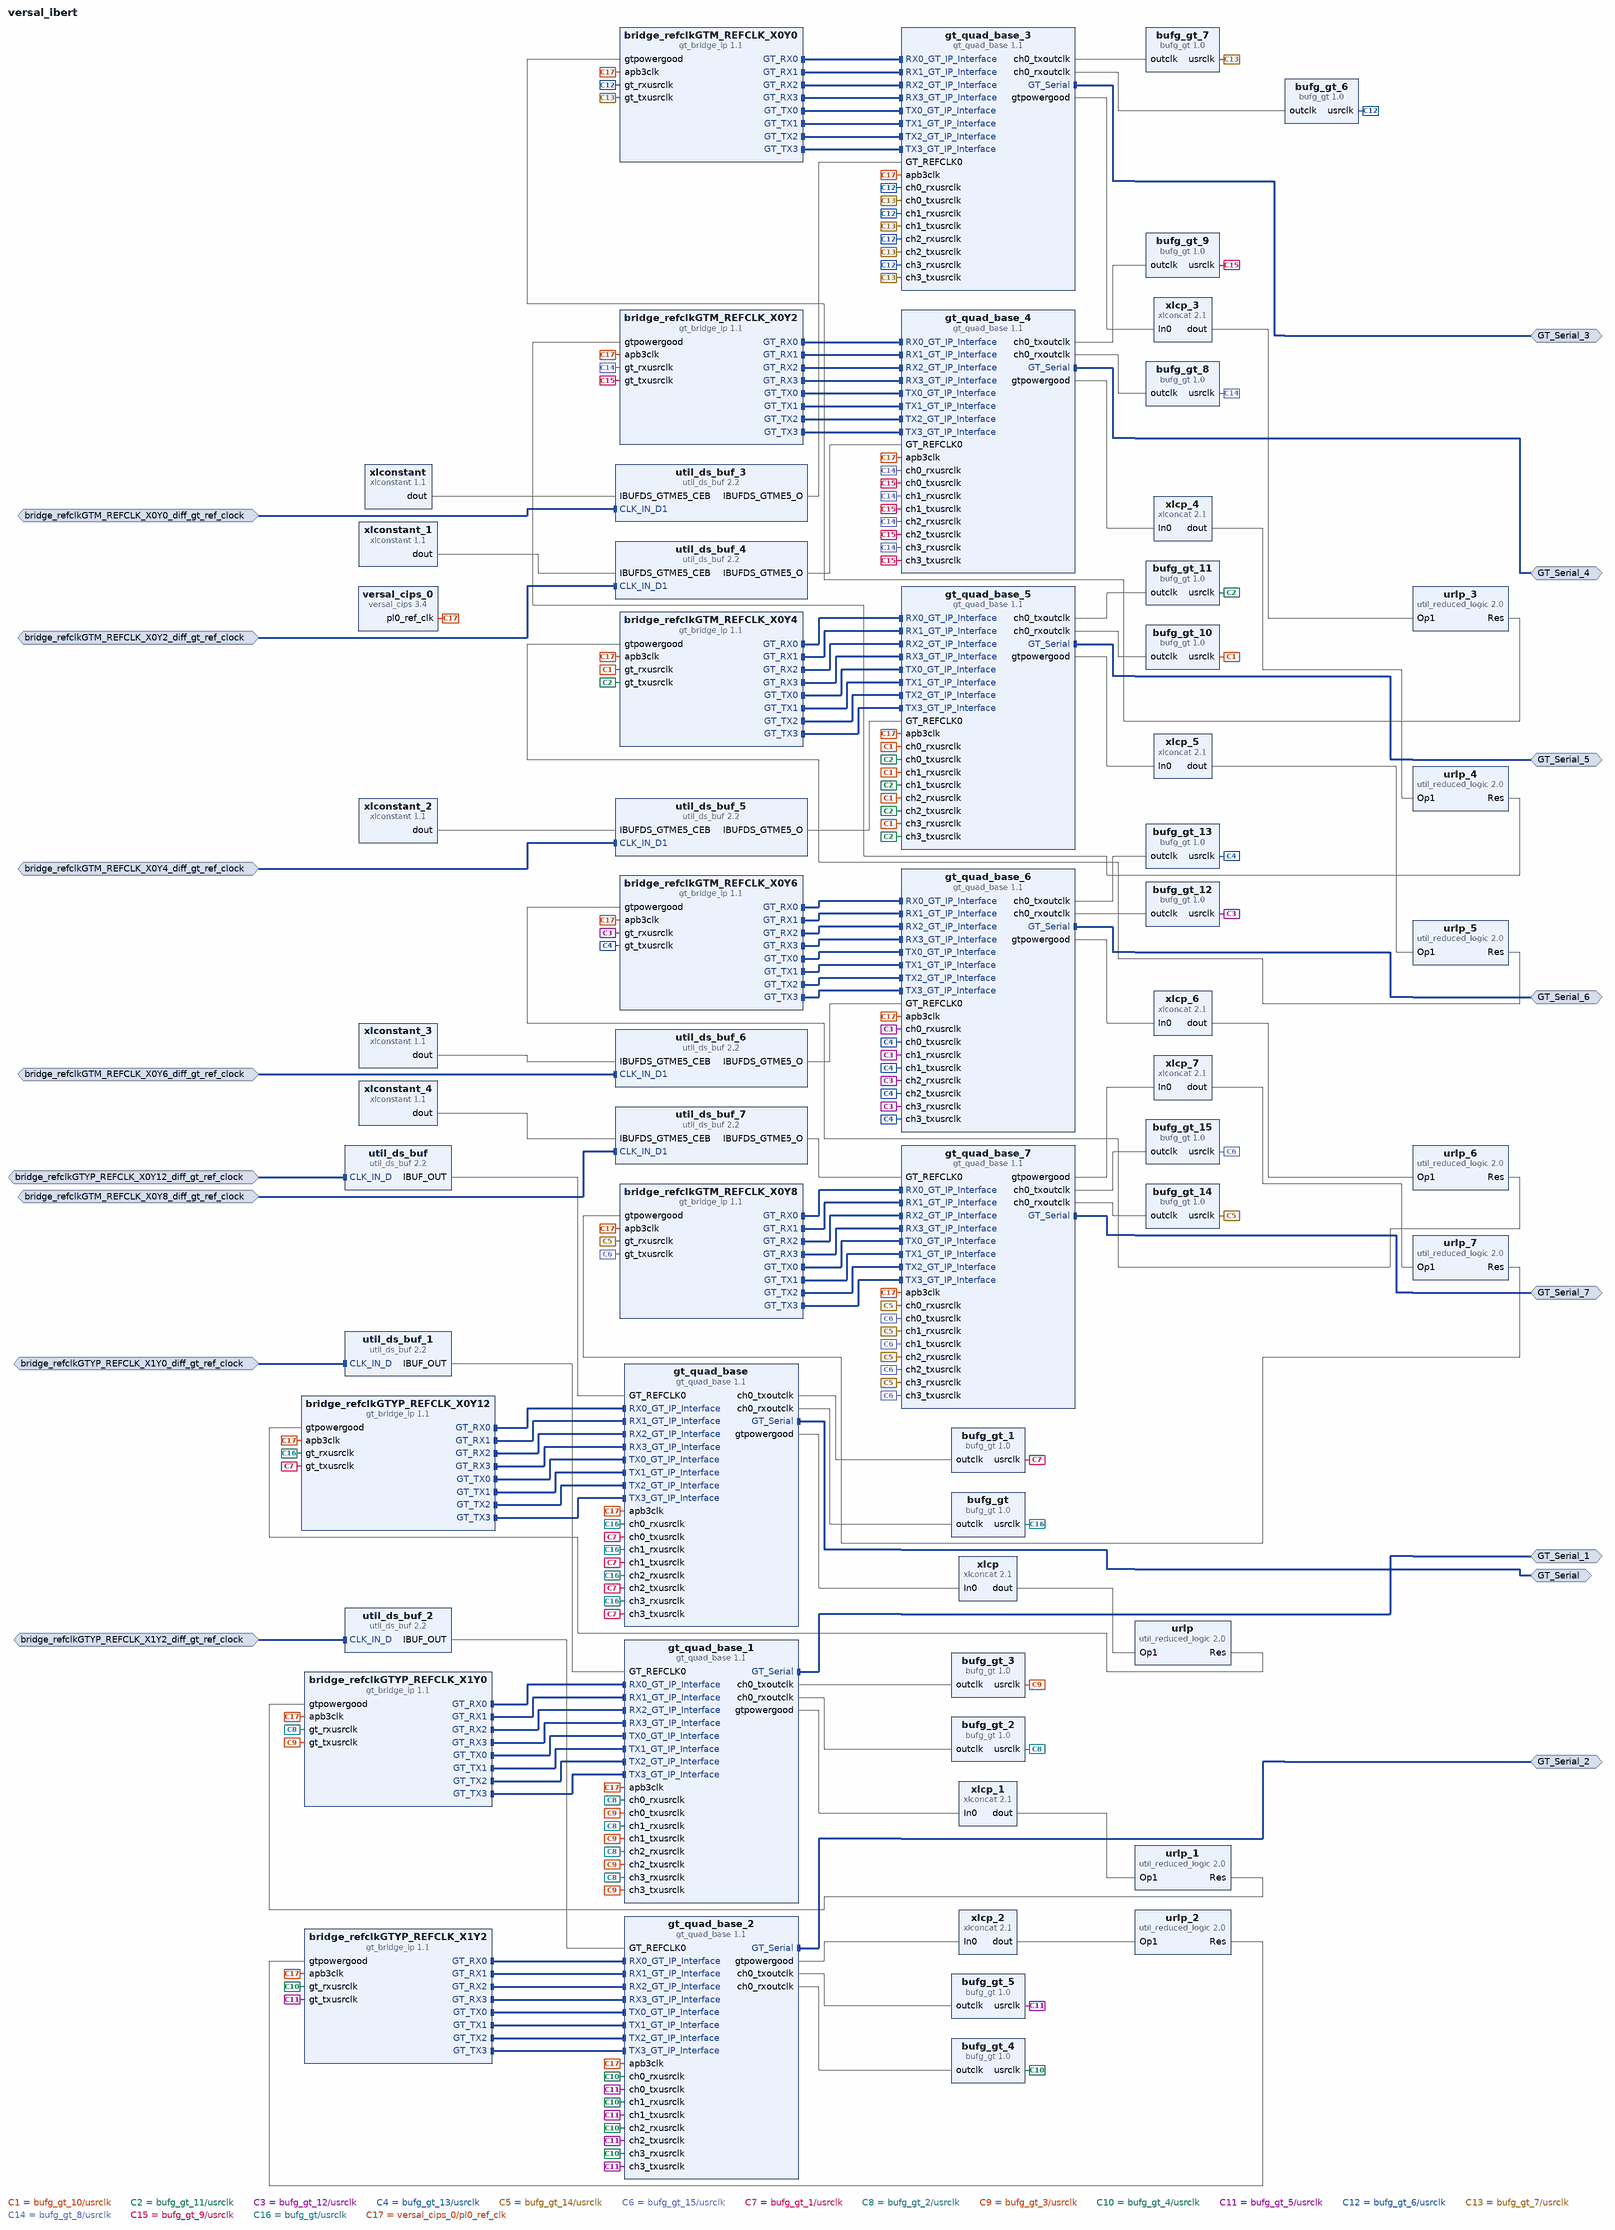
[diagram p0: block diagram of the top level]
# Vivado block design versal_ibert, xcvp1202-vsva2785-2MHP-e-S, Vivado 2023.2
create_bd_design versal_ibert

create_bd_intf_port -mode Slave -vlnv xilinx.com:interface:diff_clock_rtl:1.0 bridge_refclkGTYP_REFCLK_X0Y12_diff_gt_ref_clock
set_property -dict {CONFIG.FREQ_HZ 156250000} [get_bd_intf_ports bridge_refclkGTYP_REFCLK_X0Y12_diff_gt_ref_clock]
create_bd_intf_port -mode Master -vlnv xilinx.com:interface:gt_rtl:1.0 GT_Serial
create_bd_intf_port -mode Slave -vlnv xilinx.com:interface:diff_clock_rtl:1.0 bridge_refclkGTYP_REFCLK_X1Y0_diff_gt_ref_clock
set_property -dict {CONFIG.FREQ_HZ 156250000} [get_bd_intf_ports bridge_refclkGTYP_REFCLK_X1Y0_diff_gt_ref_clock]
create_bd_intf_port -mode Master -vlnv xilinx.com:interface:gt_rtl:1.0 GT_Serial_1
create_bd_intf_port -mode Slave -vlnv xilinx.com:interface:diff_clock_rtl:1.0 bridge_refclkGTYP_REFCLK_X1Y2_diff_gt_ref_clock
set_property -dict {CONFIG.FREQ_HZ 156250000} [get_bd_intf_ports bridge_refclkGTYP_REFCLK_X1Y2_diff_gt_ref_clock]
create_bd_intf_port -mode Master -vlnv xilinx.com:interface:gt_rtl:1.0 GT_Serial_2
create_bd_intf_port -mode Slave -vlnv xilinx.com:interface:diff_clock_rtl:1.0 bridge_refclkGTM_REFCLK_X0Y0_diff_gt_ref_clock
set_property -dict {CONFIG.FREQ_HZ 156250000} [get_bd_intf_ports bridge_refclkGTM_REFCLK_X0Y0_diff_gt_ref_clock]
create_bd_intf_port -mode Master -vlnv xilinx.com:interface:gt_rtl:1.0 GT_Serial_3
create_bd_intf_port -mode Slave -vlnv xilinx.com:interface:diff_clock_rtl:1.0 bridge_refclkGTM_REFCLK_X0Y2_diff_gt_ref_clock
set_property -dict {CONFIG.FREQ_HZ 156250000} [get_bd_intf_ports bridge_refclkGTM_REFCLK_X0Y2_diff_gt_ref_clock]
create_bd_intf_port -mode Master -vlnv xilinx.com:interface:gt_rtl:1.0 GT_Serial_4
create_bd_intf_port -mode Slave -vlnv xilinx.com:interface:diff_clock_rtl:1.0 bridge_refclkGTM_REFCLK_X0Y4_diff_gt_ref_clock
set_property -dict {CONFIG.FREQ_HZ 156250000} [get_bd_intf_ports bridge_refclkGTM_REFCLK_X0Y4_diff_gt_ref_clock]
create_bd_intf_port -mode Master -vlnv xilinx.com:interface:gt_rtl:1.0 GT_Serial_5
create_bd_intf_port -mode Slave -vlnv xilinx.com:interface:diff_clock_rtl:1.0 bridge_refclkGTM_REFCLK_X0Y6_diff_gt_ref_clock
set_property -dict {CONFIG.FREQ_HZ 156250000} [get_bd_intf_ports bridge_refclkGTM_REFCLK_X0Y6_diff_gt_ref_clock]
create_bd_intf_port -mode Master -vlnv xilinx.com:interface:gt_rtl:1.0 GT_Serial_6
create_bd_intf_port -mode Slave -vlnv xilinx.com:interface:diff_clock_rtl:1.0 bridge_refclkGTM_REFCLK_X0Y8_diff_gt_ref_clock
set_property -dict {CONFIG.FREQ_HZ 156250000} [get_bd_intf_ports bridge_refclkGTM_REFCLK_X0Y8_diff_gt_ref_clock]
create_bd_intf_port -mode Master -vlnv xilinx.com:interface:gt_rtl:1.0 GT_Serial_7

create_bd_cell -type ip -vlnv xilinx.com:ip:versal_cips:3.4 versal_cips_0
set_property -dict [list \
  CONFIG.BOOT_MODE Custom \
  CONFIG.CLOCK_MODE Custom \
  CONFIG.DDR_MEMORY_MODE Custom \
  CONFIG.DESIGN_MODE 0 \
  CONFIG.PS_PMC_CONFIG {['CLOCK_MODE Custom DESIGN_MODE 0 PMC_CRP_PL0_REF_CTRL_FREQMHZ 125 PS_BOARD_INTERFACE Custom PS_NUM_FABRIC_RESETS 0 PS_USE_PMCPL_CLK0 1 SMON_ALARMS Set_Alarms_On SMON_ENABLE_TEMP_AVERAGING 0', 'SMON_TEMP_AVERAGING_SAMPLES 0']} \
] [get_bd_cells versal_cips_0]
create_bd_cell -type ip -vlnv xilinx.com:ip:gt_bridge_ip:1.1 bridge_refclkGTYP_REFCLK_X0Y12
set_property -dict [list \
  CONFIG.GT_TYPE GTYP \
  CONFIG.IP_LR0_SETTINGS {['PRESET None RX_PAM_SEL NRZ TX_PAM_SEL NRZ TX_HD_EN 0 RX_HD_EN 0 RX_GRAY_BYP true TX_GRAY_BYP true RX_GRAY_LITTLEENDIAN true TX_GRAY_LITTLEENDIAN true RX_PRECODE_BYP true TX_PRECODE_BYP true', 'RX_PRECODE_LITTLEENDIAN false TX_PRECODE_LITTLEENDIAN false INTERNAL_PRESET None GT_TYPE GTYP GT_DIRECTION DUPLEX TX_LINE_RATE 10.3125 TX_PLL_TYPE LCPLL TX_REFCLK_FREQUENCY 156.25', 'TX_ACTUAL_REFCLK_FREQUENCY 156.250000000000 TX_FRACN_ENABLED false TX_FRACN_OVRD false TX_FRACN_NUMERATOR 0 TX_REFCLK_SOURCE R0 TX_DATA_ENCODING RAW TX_USER_DATA_WIDTH 32 TX_INT_DATA_WIDTH 32', 'TX_BUFFER_MODE 1 TX_BUFFER_BYPASS_MODE Fast_Sync TX_PIPM_ENABLE false TX_OUTCLK_SOURCE TXOUTCLKPMA TXPROGDIV_FREQ_ENABLE false TXPROGDIV_FREQ_SOURCE LCPLL TXPROGDIV_FREQ_VAL 322.265625', 'TX_DIFF_SWING_EMPH_MODE CUSTOM TX_64B66B_SCRAMBLER false TX_64B66B_ENCODER false TX_64B66B_CRC false TX_RATE_GROUP A RX_LINE_RATE 10.3125 RX_PLL_TYPE LCPLL RX_REFCLK_FREQUENCY 156.25', 'RX_ACTUAL_REFCLK_FREQUENCY 156.250000000000 RX_FRACN_ENABLED false RX_FRACN_OVRD false RX_FRACN_NUMERATOR 0 RX_REFCLK_SOURCE R0 RX_DATA_DECODING RAW RX_USER_DATA_WIDTH 32 RX_INT_DATA_WIDTH 32', 'RX_BUFFER_MODE 1 RX_OUTCLK_SOURCE RXOUTCLKPMA RXPROGDIV_FREQ_ENABLE false RXPROGDIV_FREQ_SOURCE LCPLL RXPROGDIV_FREQ_VAL 322.265625 RXRECCLK_FREQ_ENABLE false RXRECCLK_FREQ_VAL 0 INS_LOSS_NYQ 20', 'RX_EQ_MODE AUTO RX_COUPLING AC RX_TERMINATION PROGRAMMABLE RX_RATE_GROUP A RX_TERMINATION_PROG_VALUE 800 RX_PPM_OFFSET 0 RX_64B66B_DESCRAMBLER false RX_64B66B_DECODER false RX_64B66B_CRC false', 'OOB_ENABLE false RX_COMMA_ALIGN_WORD 1 RX_COMMA_SHOW_REALIGN_ENABLE true PCIE_ENABLE false TX_LANE_DESKEW_HDMI_ENABLE false RX_COMMA_P_ENABLE false RX_COMMA_M_ENABLE false RX_COMMA_DOUBLE_ENABLE false', 'RX_COMMA_P_VAL 0101111100 RX_COMMA_M_VAL 1010000011 RX_COMMA_MASK 0000000000 RX_SLIDE_MODE OFF RX_SSC_PPM 0 RX_CB_NUM_SEQ 0 RX_CB_LEN_SEQ 1 RX_CB_MAX_SKEW 1 RX_CB_MAX_LEVEL 1 RX_CB_MASK 00000000', 'RX_CB_VAL 00000000000000000000000000000000000000000000000000000000000000000000000000000000 RX_CB_K 00000000 RX_CB_DISP 00000000 RX_CB_MASK_0_0 false RX_CB_VAL_0_0 00000000 RX_CB_K_0_0 false', 'RX_CB_DISP_0_0 false RX_CB_MASK_0_1 false RX_CB_VAL_0_1 00000000 RX_CB_K_0_1 false RX_CB_DISP_0_1 false RX_CB_MASK_0_2 false RX_CB_VAL_0_2 00000000 RX_CB_K_0_2 false RX_CB_DISP_0_2 false', 'RX_CB_MASK_0_3 false RX_CB_VAL_0_3 00000000 RX_CB_K_0_3 false RX_CB_DISP_0_3 false RX_CB_MASK_1_0 false RX_CB_VAL_1_0 00000000 RX_CB_K_1_0 false RX_CB_DISP_1_0 false RX_CB_MASK_1_1 false RX_CB_VAL_1_1', '00000000 RX_CB_K_1_1 false RX_CB_DISP_1_1 false RX_CB_MASK_1_2 false RX_CB_VAL_1_2 00000000 RX_CB_K_1_2 false RX_CB_DISP_1_2 false RX_CB_MASK_1_3 false RX_CB_VAL_1_3 00000000 RX_CB_K_1_3 false', 'RX_CB_DISP_1_3 false RX_CC_NUM_SEQ 0 RX_CC_LEN_SEQ 1 RX_CC_PERIODICITY 5000 RX_CC_KEEP_IDLE DISABLE RX_CC_PRECEDENCE ENABLE RX_CC_REPEAT_WAIT 0 RX_CC_MASK 00000000 RX_CC_VAL', '00000000000000000000000000000000000000000000000000000000000000000000000000000000 RX_CC_K 00000000 RX_CC_DISP 00000000 RX_CC_MASK_0_0 false RX_CC_VAL_0_0 00000000 RX_CC_K_0_0 false RX_CC_DISP_0_0 false', 'RX_CC_MASK_0_1 false RX_CC_VAL_0_1 00000000 RX_CC_K_0_1 false RX_CC_DISP_0_1 false RX_CC_MASK_0_2 false RX_CC_VAL_0_2 00000000 RX_CC_K_0_2 false RX_CC_DISP_0_2 false RX_CC_MASK_0_3 false RX_CC_VAL_0_3', '00000000 RX_CC_K_0_3 false RX_CC_DISP_0_3 false RX_CC_MASK_1_0 false RX_CC_VAL_1_0 00000000 RX_CC_K_1_0 false RX_CC_DISP_1_0 false RX_CC_MASK_1_1 false RX_CC_VAL_1_1 00000000 RX_CC_K_1_1 false', 'RX_CC_DISP_1_1 false RX_CC_MASK_1_2 false RX_CC_VAL_1_2 00000000 RX_CC_K_1_2 false RX_CC_DISP_1_2 false RX_CC_MASK_1_3 false RX_CC_VAL_1_3 00000000 RX_CC_K_1_3 false RX_CC_DISP_1_3 false', 'PCIE_USERCLK2_FREQ 250 PCIE_USERCLK_FREQ 250 RX_JTOL_FC 6.1862627 RX_JTOL_LF_SLOPE -20 RX_BUFFER_BYPASS_MODE Fast_Sync RX_BUFFER_BYPASS_MODE_LANE MULTI RX_BUFFER_RESET_ON_CB_CHANGE ENABLE', 'RX_BUFFER_RESET_ON_COMMAALIGN DISABLE RX_BUFFER_RESET_ON_RATE_CHANGE ENABLE TX_BUFFER_RESET_ON_RATE_CHANGE ENABLE RESET_SEQUENCE_INTERVAL 0 RX_COMMA_PRESET NONE RX_COMMA_VALID_ONLY 0']} \
  CONFIG.IP_NO_OF_LANES 4 \
] [get_bd_cells bridge_refclkGTYP_REFCLK_X0Y12]
create_bd_cell -type ip -vlnv xilinx.com:ip:gt_quad_base:1.1 gt_quad_base
set_property -dict [list \
  CONFIG.APB3_CLK_FREQUENCY 124.998749 \
  CONFIG.BYPASS_DRC_58G false \
  CONFIG.CHANNEL_ORDERING {['/gt_quad_base/TX0_GT_IP_Interface versal_ibert_bridge_refclkGTYP_REFCLK_X0Y12_0./bridge_refclkGTYP_REFCLK_X0Y12/GT_TX0.0 /gt_quad_base/TX1_GT_IP_Interface', 'versal_ibert_bridge_refclkGTYP_REFCLK_X0Y12_0./bridge_refclkGTYP_REFCLK_X0Y12/GT_TX1.1 /gt_quad_base/TX2_GT_IP_Interface', 'versal_ibert_bridge_refclkGTYP_REFCLK_X0Y12_0./bridge_refclkGTYP_REFCLK_X0Y12/GT_TX2.2 /gt_quad_base/TX3_GT_IP_Interface', 'versal_ibert_bridge_refclkGTYP_REFCLK_X0Y12_0./bridge_refclkGTYP_REFCLK_X0Y12/GT_TX3.3 /gt_quad_base/RX0_GT_IP_Interface', 'versal_ibert_bridge_refclkGTYP_REFCLK_X0Y12_0./bridge_refclkGTYP_REFCLK_X0Y12/GT_RX0.0 /gt_quad_base/RX1_GT_IP_Interface', 'versal_ibert_bridge_refclkGTYP_REFCLK_X0Y12_0./bridge_refclkGTYP_REFCLK_X0Y12/GT_RX1.1 /gt_quad_base/RX2_GT_IP_Interface', 'versal_ibert_bridge_refclkGTYP_REFCLK_X0Y12_0./bridge_refclkGTYP_REFCLK_X0Y12/GT_RX2.2 /gt_quad_base/RX3_GT_IP_Interface', 'versal_ibert_bridge_refclkGTYP_REFCLK_X0Y12_0./bridge_refclkGTYP_REFCLK_X0Y12/GT_RX3.3']} \
  CONFIG.GT_TYPE GTYP \
  CONFIG.PORTS_INFO_DICT {LANE_SEL_DICT {PROT0 {RX0 RX1 RX2 RX3 TX0 TX1 TX2 TX3}} GT_TYPE GTYP REG_CONF_INTF APB3_INTF BOARD_PARAMETER { }} \
  CONFIG.PROT0_ENABLE true \
  CONFIG.PROT0_GT_DIRECTION DUPLEX \
  CONFIG.PROT0_LR0_SETTINGS {['GT_DIRECTION DUPLEX TX_PAM_SEL NRZ TX_HD_EN 0 TX_GRAY_BYP true TX_GRAY_LITTLEENDIAN true TX_PRECODE_BYP true TX_PRECODE_LITTLEENDIAN false TX_LINE_RATE 10.3125 TX_PLL_TYPE LCPLL TX_REFCLK_FREQUENCY', '156.25 TX_ACTUAL_REFCLK_FREQUENCY 156.250000000000 TX_FRACN_ENABLED false TX_FRACN_OVRD false TX_FRACN_NUMERATOR 0 TX_REFCLK_SOURCE R0 TX_DATA_ENCODING RAW TX_USER_DATA_WIDTH 32 TX_INT_DATA_WIDTH 32', 'TX_BUFFER_MODE 1 TX_BUFFER_BYPASS_MODE Fast_Sync TX_PIPM_ENABLE false TX_OUTCLK_SOURCE TXOUTCLKPMA TXPROGDIV_FREQ_ENABLE false TXPROGDIV_FREQ_SOURCE LCPLL TXPROGDIV_FREQ_VAL 322.265625', 'TX_DIFF_SWING_EMPH_MODE CUSTOM TX_64B66B_SCRAMBLER false TX_64B66B_ENCODER false TX_64B66B_CRC false TX_RATE_GROUP A TX_LANE_DESKEW_HDMI_ENABLE false TX_BUFFER_RESET_ON_RATE_CHANGE ENABLE PRESET None', 'RX_PAM_SEL NRZ RX_HD_EN 0 RX_GRAY_BYP true RX_GRAY_LITTLEENDIAN true RX_PRECODE_BYP true RX_PRECODE_LITTLEENDIAN false INTERNAL_PRESET None RX_LINE_RATE 10.3125 RX_PLL_TYPE LCPLL RX_REFCLK_FREQUENCY', '156.25 RX_ACTUAL_REFCLK_FREQUENCY 156.250000000000 RX_FRACN_ENABLED false RX_FRACN_OVRD false RX_FRACN_NUMERATOR 0 RX_REFCLK_SOURCE R0 RX_DATA_DECODING RAW RX_USER_DATA_WIDTH 32 RX_INT_DATA_WIDTH 32', 'RX_BUFFER_MODE 1 RX_OUTCLK_SOURCE RXOUTCLKPMA RXPROGDIV_FREQ_ENABLE false RXPROGDIV_FREQ_SOURCE LCPLL RXPROGDIV_FREQ_VAL 322.265625 RXRECCLK_FREQ_ENABLE false RXRECCLK_FREQ_VAL 0 INS_LOSS_NYQ 20', 'RX_EQ_MODE AUTO RX_COUPLING AC RX_TERMINATION PROGRAMMABLE RX_RATE_GROUP A RX_TERMINATION_PROG_VALUE 800 RX_PPM_OFFSET 0 RX_64B66B_DESCRAMBLER false RX_64B66B_DECODER false RX_64B66B_CRC false', 'OOB_ENABLE false RX_COMMA_ALIGN_WORD 1 RX_COMMA_SHOW_REALIGN_ENABLE true PCIE_ENABLE false RX_COMMA_P_ENABLE false RX_COMMA_M_ENABLE false RX_COMMA_DOUBLE_ENABLE false RX_COMMA_P_VAL 0101111100', 'RX_COMMA_M_VAL 1010000011 RX_COMMA_MASK 0000000000 RX_SLIDE_MODE OFF RX_SSC_PPM 0 RX_CB_NUM_SEQ 0 RX_CB_LEN_SEQ 1 RX_CB_MAX_SKEW 1 RX_CB_MAX_LEVEL 1 RX_CB_MASK 00000000 RX_CB_VAL', '00000000000000000000000000000000000000000000000000000000000000000000000000000000 RX_CB_K 00000000 RX_CB_DISP 00000000 RX_CB_MASK_0_0 false RX_CB_VAL_0_0 00000000 RX_CB_K_0_0 false RX_CB_DISP_0_0 false', 'RX_CB_MASK_0_1 false RX_CB_VAL_0_1 00000000 RX_CB_K_0_1 false RX_CB_DISP_0_1 false RX_CB_MASK_0_2 false RX_CB_VAL_0_2 00000000 RX_CB_K_0_2 false RX_CB_DISP_0_2 false RX_CB_MASK_0_3 false RX_CB_VAL_0_3', '00000000 RX_CB_K_0_3 false RX_CB_DISP_0_3 false RX_CB_MASK_1_0 false RX_CB_VAL_1_0 00000000 RX_CB_K_1_0 false RX_CB_DISP_1_0 false RX_CB_MASK_1_1 false RX_CB_VAL_1_1 00000000 RX_CB_K_1_1 false', 'RX_CB_DISP_1_1 false RX_CB_MASK_1_2 false RX_CB_VAL_1_2 00000000 RX_CB_K_1_2 false RX_CB_DISP_1_2 false RX_CB_MASK_1_3 false RX_CB_VAL_1_3 00000000 RX_CB_K_1_3 false RX_CB_DISP_1_3 false RX_CC_NUM_SEQ', '0 RX_CC_LEN_SEQ 1 RX_CC_PERIODICITY 5000 RX_CC_KEEP_IDLE DISABLE RX_CC_PRECEDENCE ENABLE RX_CC_REPEAT_WAIT 0 RX_CC_MASK 00000000 RX_CC_VAL', '00000000000000000000000000000000000000000000000000000000000000000000000000000000 RX_CC_K 00000000 RX_CC_DISP 00000000 RX_CC_MASK_0_0 false RX_CC_VAL_0_0 00000000 RX_CC_K_0_0 false RX_CC_DISP_0_0 false', 'RX_CC_MASK_0_1 false RX_CC_VAL_0_1 00000000 RX_CC_K_0_1 false RX_CC_DISP_0_1 false RX_CC_MASK_0_2 false RX_CC_VAL_0_2 00000000 RX_CC_K_0_2 false RX_CC_DISP_0_2 false RX_CC_MASK_0_3 false RX_CC_VAL_0_3', '00000000 RX_CC_K_0_3 false RX_CC_DISP_0_3 false RX_CC_MASK_1_0 false RX_CC_VAL_1_0 00000000 RX_CC_K_1_0 false RX_CC_DISP_1_0 false RX_CC_MASK_1_1 false RX_CC_VAL_1_1 00000000 RX_CC_K_1_1 false', 'RX_CC_DISP_1_1 false RX_CC_MASK_1_2 false RX_CC_VAL_1_2 00000000 RX_CC_K_1_2 false RX_CC_DISP_1_2 false RX_CC_MASK_1_3 false RX_CC_VAL_1_3 00000000 RX_CC_K_1_3 false RX_CC_DISP_1_3 false', 'PCIE_USERCLK2_FREQ 250 PCIE_USERCLK_FREQ 250 RX_JTOL_FC 6.1862627 RX_JTOL_LF_SLOPE -20 RX_BUFFER_BYPASS_MODE Fast_Sync RX_BUFFER_BYPASS_MODE_LANE MULTI RX_BUFFER_RESET_ON_CB_CHANGE ENABLE', 'RX_BUFFER_RESET_ON_COMMAALIGN DISABLE RX_BUFFER_RESET_ON_RATE_CHANGE ENABLE RESET_SEQUENCE_INTERVAL 0 RX_COMMA_PRESET NONE RX_COMMA_VALID_ONLY 0 GT_TYPE GTYP']} \
  CONFIG.PROT0_LR10_SETTINGS {NA NA} \
  CONFIG.PROT0_LR11_SETTINGS {NA NA} \
  CONFIG.PROT0_LR12_SETTINGS {NA NA} \
  CONFIG.PROT0_LR13_SETTINGS {NA NA} \
  CONFIG.PROT0_LR14_SETTINGS {NA NA} \
  CONFIG.PROT0_LR15_SETTINGS {NA NA} \
  CONFIG.PROT0_LR1_SETTINGS {NA NA} \
  CONFIG.PROT0_LR2_SETTINGS {NA NA} \
  CONFIG.PROT0_LR3_SETTINGS {NA NA} \
  CONFIG.PROT0_LR4_SETTINGS {NA NA} \
  CONFIG.PROT0_LR5_SETTINGS {NA NA} \
  CONFIG.PROT0_LR6_SETTINGS {NA NA} \
  CONFIG.PROT0_LR7_SETTINGS {NA NA} \
  CONFIG.PROT0_LR8_SETTINGS {NA NA} \
  CONFIG.PROT0_LR9_SETTINGS {NA NA} \
  CONFIG.PROT0_NO_OF_LANES 4 \
  CONFIG.PROT0_RX_MASTERCLK_SRC RX0 \
  CONFIG.PROT0_TX_MASTERCLK_SRC TX0 \
  CONFIG.QUAD_USAGE {['TX_QUAD_CH {', 'TXQuad_0_/gt_quad_base {/gt_quad_base', 'versal_ibert_bridge_refclkGTYP_REFCLK_X0Y12_0.IP_CH0,versal_ibert_bridge_refclkGTYP_REFCLK_X0Y12_0.IP_CH1,versal_ibert_bridge_refclkGTYP_REFCLK_X0Y12_0.IP_CH2,versal_ibert_bridge_refclkGTYP_REFCLK_X0Y12_0.IP_CH3', 'MSTRCLK 1,0,0,0 IS_CURRENT_QUAD 1}', '}', 'RX_QUAD_CH {', 'RXQuad_0_/gt_quad_base {/gt_quad_base', 'versal_ibert_bridge_refclkGTYP_REFCLK_X0Y12_0.IP_CH0,versal_ibert_bridge_refclkGTYP_REFCLK_X0Y12_0.IP_CH1,versal_ibert_bridge_refclkGTYP_REFCLK_X0Y12_0.IP_CH2,versal_ibert_bridge_refclkGTYP_REFCLK_X0Y12_0.IP_CH3', 'MSTRCLK 1,0,0,0 IS_CURRENT_QUAD 1}', '}']} \
  CONFIG.REFCLK_LIST {{/bridge_refclkGTYP_REFCLK_X0Y12_diff_gt_ref_clock_clk_p[0]}} \
  CONFIG.REFCLK_STRING {HSCLK0_LCPLLGTREFCLK0 refclk_PROT0_R0_156.25_MHz_unique1 HSCLK1_LCPLLGTREFCLK0 refclk_PROT0_R0_156.25_MHz_unique1} \
  CONFIG.REG_CONF_INTF APB3_INTF \
  CONFIG.RX0_LANE_SEL PROT0 \
  CONFIG.RX1_LANE_SEL PROT0 \
  CONFIG.RX2_LANE_SEL PROT0 \
  CONFIG.RX3_LANE_SEL PROT0 \
  CONFIG.TX0_LANE_SEL PROT0 \
  CONFIG.TX1_LANE_SEL PROT0 \
  CONFIG.TX2_LANE_SEL PROT0 \
  CONFIG.TX3_LANE_SEL PROT0 \
] [get_bd_cells gt_quad_base]
create_bd_cell -type ip -vlnv xilinx.com:ip:bufg_gt:1.0 bufg_gt
create_bd_cell -type ip -vlnv xilinx.com:ip:bufg_gt:1.0 bufg_gt_1
create_bd_cell -type ip -vlnv xilinx.com:ip:util_reduced_logic:2.0 urlp
set_property -dict {CONFIG.C_SIZE 1} [get_bd_cells urlp]
create_bd_cell -type ip -vlnv xilinx.com:ip:xlconcat:2.1 xlcp
set_property -dict {CONFIG.NUM_PORTS 1} [get_bd_cells xlcp]
create_bd_cell -type ip -vlnv xilinx.com:ip:util_ds_buf:2.2 util_ds_buf
set_property -dict {CONFIG.C_BUF_TYPE IBUFDSGTE} [get_bd_cells util_ds_buf]
create_bd_cell -type ip -vlnv xilinx.com:ip:gt_bridge_ip:1.1 bridge_refclkGTYP_REFCLK_X1Y0
set_property -dict [list \
  CONFIG.GT_TYPE GTYP \
  CONFIG.IP_LR0_SETTINGS {['PRESET None RX_PAM_SEL NRZ TX_PAM_SEL NRZ TX_HD_EN 0 RX_HD_EN 0 RX_GRAY_BYP true TX_GRAY_BYP true RX_GRAY_LITTLEENDIAN true TX_GRAY_LITTLEENDIAN true RX_PRECODE_BYP true TX_PRECODE_BYP true', 'RX_PRECODE_LITTLEENDIAN false TX_PRECODE_LITTLEENDIAN false INTERNAL_PRESET None GT_TYPE GTYP GT_DIRECTION DUPLEX TX_LINE_RATE 10.3125 TX_PLL_TYPE LCPLL TX_REFCLK_FREQUENCY 156.25', 'TX_ACTUAL_REFCLK_FREQUENCY 156.250000000000 TX_FRACN_ENABLED false TX_FRACN_OVRD false TX_FRACN_NUMERATOR 0 TX_REFCLK_SOURCE R0 TX_DATA_ENCODING RAW TX_USER_DATA_WIDTH 32 TX_INT_DATA_WIDTH 32', 'TX_BUFFER_MODE 1 TX_BUFFER_BYPASS_MODE Fast_Sync TX_PIPM_ENABLE false TX_OUTCLK_SOURCE TXOUTCLKPMA TXPROGDIV_FREQ_ENABLE false TXPROGDIV_FREQ_SOURCE LCPLL TXPROGDIV_FREQ_VAL 322.265625', 'TX_DIFF_SWING_EMPH_MODE CUSTOM TX_64B66B_SCRAMBLER false TX_64B66B_ENCODER false TX_64B66B_CRC false TX_RATE_GROUP A RX_LINE_RATE 10.3125 RX_PLL_TYPE LCPLL RX_REFCLK_FREQUENCY 156.25', 'RX_ACTUAL_REFCLK_FREQUENCY 156.250000000000 RX_FRACN_ENABLED false RX_FRACN_OVRD false RX_FRACN_NUMERATOR 0 RX_REFCLK_SOURCE R0 RX_DATA_DECODING RAW RX_USER_DATA_WIDTH 32 RX_INT_DATA_WIDTH 32', 'RX_BUFFER_MODE 1 RX_OUTCLK_SOURCE RXOUTCLKPMA RXPROGDIV_FREQ_ENABLE false RXPROGDIV_FREQ_SOURCE LCPLL RXPROGDIV_FREQ_VAL 322.265625 RXRECCLK_FREQ_ENABLE false RXRECCLK_FREQ_VAL 0 INS_LOSS_NYQ 20', 'RX_EQ_MODE AUTO RX_COUPLING AC RX_TERMINATION PROGRAMMABLE RX_RATE_GROUP A RX_TERMINATION_PROG_VALUE 800 RX_PPM_OFFSET 0 RX_64B66B_DESCRAMBLER false RX_64B66B_DECODER false RX_64B66B_CRC false', 'OOB_ENABLE false RX_COMMA_ALIGN_WORD 1 RX_COMMA_SHOW_REALIGN_ENABLE true PCIE_ENABLE false TX_LANE_DESKEW_HDMI_ENABLE false RX_COMMA_P_ENABLE false RX_COMMA_M_ENABLE false RX_COMMA_DOUBLE_ENABLE false', 'RX_COMMA_P_VAL 0101111100 RX_COMMA_M_VAL 1010000011 RX_COMMA_MASK 0000000000 RX_SLIDE_MODE OFF RX_SSC_PPM 0 RX_CB_NUM_SEQ 0 RX_CB_LEN_SEQ 1 RX_CB_MAX_SKEW 1 RX_CB_MAX_LEVEL 1 RX_CB_MASK 00000000', 'RX_CB_VAL 00000000000000000000000000000000000000000000000000000000000000000000000000000000 RX_CB_K 00000000 RX_CB_DISP 00000000 RX_CB_MASK_0_0 false RX_CB_VAL_0_0 00000000 RX_CB_K_0_0 false', 'RX_CB_DISP_0_0 false RX_CB_MASK_0_1 false RX_CB_VAL_0_1 00000000 RX_CB_K_0_1 false RX_CB_DISP_0_1 false RX_CB_MASK_0_2 false RX_CB_VAL_0_2 00000000 RX_CB_K_0_2 false RX_CB_DISP_0_2 false', 'RX_CB_MASK_0_3 false RX_CB_VAL_0_3 00000000 RX_CB_K_0_3 false RX_CB_DISP_0_3 false RX_CB_MASK_1_0 false RX_CB_VAL_1_0 00000000 RX_CB_K_1_0 false RX_CB_DISP_1_0 false RX_CB_MASK_1_1 false RX_CB_VAL_1_1', '00000000 RX_CB_K_1_1 false RX_CB_DISP_1_1 false RX_CB_MASK_1_2 false RX_CB_VAL_1_2 00000000 RX_CB_K_1_2 false RX_CB_DISP_1_2 false RX_CB_MASK_1_3 false RX_CB_VAL_1_3 00000000 RX_CB_K_1_3 false', 'RX_CB_DISP_1_3 false RX_CC_NUM_SEQ 0 RX_CC_LEN_SEQ 1 RX_CC_PERIODICITY 5000 RX_CC_KEEP_IDLE DISABLE RX_CC_PRECEDENCE ENABLE RX_CC_REPEAT_WAIT 0 RX_CC_MASK 00000000 RX_CC_VAL', '00000000000000000000000000000000000000000000000000000000000000000000000000000000 RX_CC_K 00000000 RX_CC_DISP 00000000 RX_CC_MASK_0_0 false RX_CC_VAL_0_0 00000000 RX_CC_K_0_0 false RX_CC_DISP_0_0 false', 'RX_CC_MASK_0_1 false RX_CC_VAL_0_1 00000000 RX_CC_K_0_1 false RX_CC_DISP_0_1 false RX_CC_MASK_0_2 false RX_CC_VAL_0_2 00000000 RX_CC_K_0_2 false RX_CC_DISP_0_2 false RX_CC_MASK_0_3 false RX_CC_VAL_0_3', '00000000 RX_CC_K_0_3 false RX_CC_DISP_0_3 false RX_CC_MASK_1_0 false RX_CC_VAL_1_0 00000000 RX_CC_K_1_0 false RX_CC_DISP_1_0 false RX_CC_MASK_1_1 false RX_CC_VAL_1_1 00000000 RX_CC_K_1_1 false', 'RX_CC_DISP_1_1 false RX_CC_MASK_1_2 false RX_CC_VAL_1_2 00000000 RX_CC_K_1_2 false RX_CC_DISP_1_2 false RX_CC_MASK_1_3 false RX_CC_VAL_1_3 00000000 RX_CC_K_1_3 false RX_CC_DISP_1_3 false', 'PCIE_USERCLK2_FREQ 250 PCIE_USERCLK_FREQ 250 RX_JTOL_FC 6.1862627 RX_JTOL_LF_SLOPE -20 RX_BUFFER_BYPASS_MODE Fast_Sync RX_BUFFER_BYPASS_MODE_LANE MULTI RX_BUFFER_RESET_ON_CB_CHANGE ENABLE', 'RX_BUFFER_RESET_ON_COMMAALIGN DISABLE RX_BUFFER_RESET_ON_RATE_CHANGE ENABLE TX_BUFFER_RESET_ON_RATE_CHANGE ENABLE RESET_SEQUENCE_INTERVAL 0 RX_COMMA_PRESET NONE RX_COMMA_VALID_ONLY 0']} \
  CONFIG.IP_NO_OF_LANES 4 \
] [get_bd_cells bridge_refclkGTYP_REFCLK_X1Y0]
create_bd_cell -type ip -vlnv xilinx.com:ip:gt_quad_base:1.1 gt_quad_base_1
set_property -dict [list \
  CONFIG.APB3_CLK_FREQUENCY 124.998749 \
  CONFIG.BYPASS_DRC_58G false \
  CONFIG.CHANNEL_ORDERING {['/gt_quad_base_1/TX0_GT_IP_Interface versal_ibert_bridge_refclkGTYP_REFCLK_X1Y0_0./bridge_refclkGTYP_REFCLK_X1Y0/GT_TX0.0 /gt_quad_base_1/TX1_GT_IP_Interface', 'versal_ibert_bridge_refclkGTYP_REFCLK_X1Y0_0./bridge_refclkGTYP_REFCLK_X1Y0/GT_TX1.1 /gt_quad_base_1/TX2_GT_IP_Interface', 'versal_ibert_bridge_refclkGTYP_REFCLK_X1Y0_0./bridge_refclkGTYP_REFCLK_X1Y0/GT_TX2.2 /gt_quad_base_1/TX3_GT_IP_Interface', 'versal_ibert_bridge_refclkGTYP_REFCLK_X1Y0_0./bridge_refclkGTYP_REFCLK_X1Y0/GT_TX3.3 /gt_quad_base_1/RX0_GT_IP_Interface', 'versal_ibert_bridge_refclkGTYP_REFCLK_X1Y0_0./bridge_refclkGTYP_REFCLK_X1Y0/GT_RX0.0 /gt_quad_base_1/RX1_GT_IP_Interface', 'versal_ibert_bridge_refclkGTYP_REFCLK_X1Y0_0./bridge_refclkGTYP_REFCLK_X1Y0/GT_RX1.1 /gt_quad_base_1/RX2_GT_IP_Interface', 'versal_ibert_bridge_refclkGTYP_REFCLK_X1Y0_0./bridge_refclkGTYP_REFCLK_X1Y0/GT_RX2.2 /gt_quad_base_1/RX3_GT_IP_Interface', 'versal_ibert_bridge_refclkGTYP_REFCLK_X1Y0_0./bridge_refclkGTYP_REFCLK_X1Y0/GT_RX3.3']} \
  CONFIG.GT_TYPE GTYP \
  CONFIG.PORTS_INFO_DICT {LANE_SEL_DICT {PROT0 {RX0 RX1 RX2 RX3 TX0 TX1 TX2 TX3}} GT_TYPE GTYP REG_CONF_INTF APB3_INTF BOARD_PARAMETER { }} \
  CONFIG.PROT0_ENABLE true \
  CONFIG.PROT0_GT_DIRECTION DUPLEX \
  CONFIG.PROT0_LR0_SETTINGS {['GT_DIRECTION DUPLEX TX_PAM_SEL NRZ TX_HD_EN 0 TX_GRAY_BYP true TX_GRAY_LITTLEENDIAN true TX_PRECODE_BYP true TX_PRECODE_LITTLEENDIAN false TX_LINE_RATE 10.3125 TX_PLL_TYPE LCPLL TX_REFCLK_FREQUENCY', '156.25 TX_ACTUAL_REFCLK_FREQUENCY 156.250000000000 TX_FRACN_ENABLED false TX_FRACN_OVRD false TX_FRACN_NUMERATOR 0 TX_REFCLK_SOURCE R0 TX_DATA_ENCODING RAW TX_USER_DATA_WIDTH 32 TX_INT_DATA_WIDTH 32', 'TX_BUFFER_MODE 1 TX_BUFFER_BYPASS_MODE Fast_Sync TX_PIPM_ENABLE false TX_OUTCLK_SOURCE TXOUTCLKPMA TXPROGDIV_FREQ_ENABLE false TXPROGDIV_FREQ_SOURCE LCPLL TXPROGDIV_FREQ_VAL 322.265625', 'TX_DIFF_SWING_EMPH_MODE CUSTOM TX_64B66B_SCRAMBLER false TX_64B66B_ENCODER false TX_64B66B_CRC false TX_RATE_GROUP A TX_LANE_DESKEW_HDMI_ENABLE false TX_BUFFER_RESET_ON_RATE_CHANGE ENABLE PRESET None', 'RX_PAM_SEL NRZ RX_HD_EN 0 RX_GRAY_BYP true RX_GRAY_LITTLEENDIAN true RX_PRECODE_BYP true RX_PRECODE_LITTLEENDIAN false INTERNAL_PRESET None RX_LINE_RATE 10.3125 RX_PLL_TYPE LCPLL RX_REFCLK_FREQUENCY', '156.25 RX_ACTUAL_REFCLK_FREQUENCY 156.250000000000 RX_FRACN_ENABLED false RX_FRACN_OVRD false RX_FRACN_NUMERATOR 0 RX_REFCLK_SOURCE R0 RX_DATA_DECODING RAW RX_USER_DATA_WIDTH 32 RX_INT_DATA_WIDTH 32', 'RX_BUFFER_MODE 1 RX_OUTCLK_SOURCE RXOUTCLKPMA RXPROGDIV_FREQ_ENABLE false RXPROGDIV_FREQ_SOURCE LCPLL RXPROGDIV_FREQ_VAL 322.265625 RXRECCLK_FREQ_ENABLE false RXRECCLK_FREQ_VAL 0 INS_LOSS_NYQ 20', 'RX_EQ_MODE AUTO RX_COUPLING AC RX_TERMINATION PROGRAMMABLE RX_RATE_GROUP A RX_TERMINATION_PROG_VALUE 800 RX_PPM_OFFSET 0 RX_64B66B_DESCRAMBLER false RX_64B66B_DECODER false RX_64B66B_CRC false', 'OOB_ENABLE false RX_COMMA_ALIGN_WORD 1 RX_COMMA_SHOW_REALIGN_ENABLE true PCIE_ENABLE false RX_COMMA_P_ENABLE false RX_COMMA_M_ENABLE false RX_COMMA_DOUBLE_ENABLE false RX_COMMA_P_VAL 0101111100', 'RX_COMMA_M_VAL 1010000011 RX_COMMA_MASK 0000000000 RX_SLIDE_MODE OFF RX_SSC_PPM 0 RX_CB_NUM_SEQ 0 RX_CB_LEN_SEQ 1 RX_CB_MAX_SKEW 1 RX_CB_MAX_LEVEL 1 RX_CB_MASK 00000000 RX_CB_VAL', '00000000000000000000000000000000000000000000000000000000000000000000000000000000 RX_CB_K 00000000 RX_CB_DISP 00000000 RX_CB_MASK_0_0 false RX_CB_VAL_0_0 00000000 RX_CB_K_0_0 false RX_CB_DISP_0_0 false', 'RX_CB_MASK_0_1 false RX_CB_VAL_0_1 00000000 RX_CB_K_0_1 false RX_CB_DISP_0_1 false RX_CB_MASK_0_2 false RX_CB_VAL_0_2 00000000 RX_CB_K_0_2 false RX_CB_DISP_0_2 false RX_CB_MASK_0_3 false RX_CB_VAL_0_3', '00000000 RX_CB_K_0_3 false RX_CB_DISP_0_3 false RX_CB_MASK_1_0 false RX_CB_VAL_1_0 00000000 RX_CB_K_1_0 false RX_CB_DISP_1_0 false RX_CB_MASK_1_1 false RX_CB_VAL_1_1 00000000 RX_CB_K_1_1 false', 'RX_CB_DISP_1_1 false RX_CB_MASK_1_2 false RX_CB_VAL_1_2 00000000 RX_CB_K_1_2 false RX_CB_DISP_1_2 false RX_CB_MASK_1_3 false RX_CB_VAL_1_3 00000000 RX_CB_K_1_3 false RX_CB_DISP_1_3 false RX_CC_NUM_SEQ', '0 RX_CC_LEN_SEQ 1 RX_CC_PERIODICITY 5000 RX_CC_KEEP_IDLE DISABLE RX_CC_PRECEDENCE ENABLE RX_CC_REPEAT_WAIT 0 RX_CC_MASK 00000000 RX_CC_VAL', '00000000000000000000000000000000000000000000000000000000000000000000000000000000 RX_CC_K 00000000 RX_CC_DISP 00000000 RX_CC_MASK_0_0 false RX_CC_VAL_0_0 00000000 RX_CC_K_0_0 false RX_CC_DISP_0_0 false', 'RX_CC_MASK_0_1 false RX_CC_VAL_0_1 00000000 RX_CC_K_0_1 false RX_CC_DISP_0_1 false RX_CC_MASK_0_2 false RX_CC_VAL_0_2 00000000 RX_CC_K_0_2 false RX_CC_DISP_0_2 false RX_CC_MASK_0_3 false RX_CC_VAL_0_3', '00000000 RX_CC_K_0_3 false RX_CC_DISP_0_3 false RX_CC_MASK_1_0 false RX_CC_VAL_1_0 00000000 RX_CC_K_1_0 false RX_CC_DISP_1_0 false RX_CC_MASK_1_1 false RX_CC_VAL_1_1 00000000 RX_CC_K_1_1 false', 'RX_CC_DISP_1_1 false RX_CC_MASK_1_2 false RX_CC_VAL_1_2 00000000 RX_CC_K_1_2 false RX_CC_DISP_1_2 false RX_CC_MASK_1_3 false RX_CC_VAL_1_3 00000000 RX_CC_K_1_3 false RX_CC_DISP_1_3 false', 'PCIE_USERCLK2_FREQ 250 PCIE_USERCLK_FREQ 250 RX_JTOL_FC 6.1862627 RX_JTOL_LF_SLOPE -20 RX_BUFFER_BYPASS_MODE Fast_Sync RX_BUFFER_BYPASS_MODE_LANE MULTI RX_BUFFER_RESET_ON_CB_CHANGE ENABLE', 'RX_BUFFER_RESET_ON_COMMAALIGN DISABLE RX_BUFFER_RESET_ON_RATE_CHANGE ENABLE RESET_SEQUENCE_INTERVAL 0 RX_COMMA_PRESET NONE RX_COMMA_VALID_ONLY 0 GT_TYPE GTYP']} \
  CONFIG.PROT0_LR10_SETTINGS {NA NA} \
  CONFIG.PROT0_LR11_SETTINGS {NA NA} \
  CONFIG.PROT0_LR12_SETTINGS {NA NA} \
  CONFIG.PROT0_LR13_SETTINGS {NA NA} \
  CONFIG.PROT0_LR14_SETTINGS {NA NA} \
  CONFIG.PROT0_LR15_SETTINGS {NA NA} \
  CONFIG.PROT0_LR1_SETTINGS {NA NA} \
  CONFIG.PROT0_LR2_SETTINGS {NA NA} \
  CONFIG.PROT0_LR3_SETTINGS {NA NA} \
  CONFIG.PROT0_LR4_SETTINGS {NA NA} \
  CONFIG.PROT0_LR5_SETTINGS {NA NA} \
  CONFIG.PROT0_LR6_SETTINGS {NA NA} \
  CONFIG.PROT0_LR7_SETTINGS {NA NA} \
  CONFIG.PROT0_LR8_SETTINGS {NA NA} \
  CONFIG.PROT0_LR9_SETTINGS {NA NA} \
  CONFIG.PROT0_NO_OF_LANES 4 \
  CONFIG.PROT0_RX_MASTERCLK_SRC RX0 \
  CONFIG.PROT0_TX_MASTERCLK_SRC TX0 \
  CONFIG.QUAD_USAGE {['TX_QUAD_CH {', 'TXQuad_0_/gt_quad_base_1 {/gt_quad_base_1', 'versal_ibert_bridge_refclkGTYP_REFCLK_X1Y0_0.IP_CH0,versal_ibert_bridge_refclkGTYP_REFCLK_X1Y0_0.IP_CH1,versal_ibert_bridge_refclkGTYP_REFCLK_X1Y0_0.IP_CH2,versal_ibert_bridge_refclkGTYP_REFCLK_X1Y0_0.IP_CH3', 'MSTRCLK 1,0,0,0 IS_CURRENT_QUAD 1}', '}', 'RX_QUAD_CH {', 'RXQuad_0_/gt_quad_base_1 {/gt_quad_base_1', 'versal_ibert_bridge_refclkGTYP_REFCLK_X1Y0_0.IP_CH0,versal_ibert_bridge_refclkGTYP_REFCLK_X1Y0_0.IP_CH1,versal_ibert_bridge_refclkGTYP_REFCLK_X1Y0_0.IP_CH2,versal_ibert_bridge_refclkGTYP_REFCLK_X1Y0_0.IP_CH3', 'MSTRCLK 1,0,0,0 IS_CURRENT_QUAD 1}', '}']} \
  CONFIG.REFCLK_LIST {{/bridge_refclkGTYP_REFCLK_X1Y0_diff_gt_ref_clock_clk_p[0]}} \
  CONFIG.REFCLK_STRING {HSCLK0_LCPLLGTREFCLK0 refclk_PROT0_R0_156.25_MHz_unique1 HSCLK1_LCPLLGTREFCLK0 refclk_PROT0_R0_156.25_MHz_unique1} \
  CONFIG.REG_CONF_INTF APB3_INTF \
  CONFIG.RX0_LANE_SEL PROT0 \
  CONFIG.RX1_LANE_SEL PROT0 \
  CONFIG.RX2_LANE_SEL PROT0 \
  CONFIG.RX3_LANE_SEL PROT0 \
  CONFIG.TX0_LANE_SEL PROT0 \
  CONFIG.TX1_LANE_SEL PROT0 \
  CONFIG.TX2_LANE_SEL PROT0 \
  CONFIG.TX3_LANE_SEL PROT0 \
] [get_bd_cells gt_quad_base_1]
create_bd_cell -type ip -vlnv xilinx.com:ip:bufg_gt:1.0 bufg_gt_2
create_bd_cell -type ip -vlnv xilinx.com:ip:bufg_gt:1.0 bufg_gt_3
create_bd_cell -type ip -vlnv xilinx.com:ip:util_reduced_logic:2.0 urlp_1
set_property -dict {CONFIG.C_SIZE 1} [get_bd_cells urlp_1]
create_bd_cell -type ip -vlnv xilinx.com:ip:xlconcat:2.1 xlcp_1
set_property -dict {CONFIG.NUM_PORTS 1} [get_bd_cells xlcp_1]
create_bd_cell -type ip -vlnv xilinx.com:ip:util_ds_buf:2.2 util_ds_buf_1
set_property -dict {CONFIG.C_BUF_TYPE IBUFDSGTE} [get_bd_cells util_ds_buf_1]
create_bd_cell -type ip -vlnv xilinx.com:ip:gt_bridge_ip:1.1 bridge_refclkGTYP_REFCLK_X1Y2
set_property -dict [list \
  CONFIG.GT_TYPE GTYP \
  CONFIG.IP_LR0_SETTINGS {['PRESET None RX_PAM_SEL NRZ TX_PAM_SEL NRZ TX_HD_EN 0 RX_HD_EN 0 RX_GRAY_BYP true TX_GRAY_BYP true RX_GRAY_LITTLEENDIAN true TX_GRAY_LITTLEENDIAN true RX_PRECODE_BYP true TX_PRECODE_BYP true', 'RX_PRECODE_LITTLEENDIAN false TX_PRECODE_LITTLEENDIAN false INTERNAL_PRESET None GT_TYPE GTYP GT_DIRECTION DUPLEX TX_LINE_RATE 10.3125 TX_PLL_TYPE LCPLL TX_REFCLK_FREQUENCY 156.25', 'TX_ACTUAL_REFCLK_FREQUENCY 156.250000000000 TX_FRACN_ENABLED false TX_FRACN_OVRD false TX_FRACN_NUMERATOR 0 TX_REFCLK_SOURCE R0 TX_DATA_ENCODING RAW TX_USER_DATA_WIDTH 32 TX_INT_DATA_WIDTH 32', 'TX_BUFFER_MODE 1 TX_BUFFER_BYPASS_MODE Fast_Sync TX_PIPM_ENABLE false TX_OUTCLK_SOURCE TXOUTCLKPMA TXPROGDIV_FREQ_ENABLE false TXPROGDIV_FREQ_SOURCE LCPLL TXPROGDIV_FREQ_VAL 322.265625', 'TX_DIFF_SWING_EMPH_MODE CUSTOM TX_64B66B_SCRAMBLER false TX_64B66B_ENCODER false TX_64B66B_CRC false TX_RATE_GROUP A RX_LINE_RATE 10.3125 RX_PLL_TYPE LCPLL RX_REFCLK_FREQUENCY 156.25', 'RX_ACTUAL_REFCLK_FREQUENCY 156.250000000000 RX_FRACN_ENABLED false RX_FRACN_OVRD false RX_FRACN_NUMERATOR 0 RX_REFCLK_SOURCE R0 RX_DATA_DECODING RAW RX_USER_DATA_WIDTH 32 RX_INT_DATA_WIDTH 32', 'RX_BUFFER_MODE 1 RX_OUTCLK_SOURCE RXOUTCLKPMA RXPROGDIV_FREQ_ENABLE false RXPROGDIV_FREQ_SOURCE LCPLL RXPROGDIV_FREQ_VAL 322.265625 RXRECCLK_FREQ_ENABLE false RXRECCLK_FREQ_VAL 0 INS_LOSS_NYQ 20', 'RX_EQ_MODE AUTO RX_COUPLING AC RX_TERMINATION PROGRAMMABLE RX_RATE_GROUP A RX_TERMINATION_PROG_VALUE 800 RX_PPM_OFFSET 0 RX_64B66B_DESCRAMBLER false RX_64B66B_DECODER false RX_64B66B_CRC false', 'OOB_ENABLE false RX_COMMA_ALIGN_WORD 1 RX_COMMA_SHOW_REALIGN_ENABLE true PCIE_ENABLE false TX_LANE_DESKEW_HDMI_ENABLE false RX_COMMA_P_ENABLE false RX_COMMA_M_ENABLE false RX_COMMA_DOUBLE_ENABLE false', 'RX_COMMA_P_VAL 0101111100 RX_COMMA_M_VAL 1010000011 RX_COMMA_MASK 0000000000 RX_SLIDE_MODE OFF RX_SSC_PPM 0 RX_CB_NUM_SEQ 0 RX_CB_LEN_SEQ 1 RX_CB_MAX_SKEW 1 RX_CB_MAX_LEVEL 1 RX_CB_MASK 00000000', 'RX_CB_VAL 00000000000000000000000000000000000000000000000000000000000000000000000000000000 RX_CB_K 00000000 RX_CB_DISP 00000000 RX_CB_MASK_0_0 false RX_CB_VAL_0_0 00000000 RX_CB_K_0_0 false', 'RX_CB_DISP_0_0 false RX_CB_MASK_0_1 false RX_CB_VAL_0_1 00000000 RX_CB_K_0_1 false RX_CB_DISP_0_1 false RX_CB_MASK_0_2 false RX_CB_VAL_0_2 00000000 RX_CB_K_0_2 false RX_CB_DISP_0_2 false', 'RX_CB_MASK_0_3 false RX_CB_VAL_0_3 00000000 RX_CB_K_0_3 false RX_CB_DISP_0_3 false RX_CB_MASK_1_0 false RX_CB_VAL_1_0 00000000 RX_CB_K_1_0 false RX_CB_DISP_1_0 false RX_CB_MASK_1_1 false RX_CB_VAL_1_1', '00000000 RX_CB_K_1_1 false RX_CB_DISP_1_1 false RX_CB_MASK_1_2 false RX_CB_VAL_1_2 00000000 RX_CB_K_1_2 false RX_CB_DISP_1_2 false RX_CB_MASK_1_3 false RX_CB_VAL_1_3 00000000 RX_CB_K_1_3 false', 'RX_CB_DISP_1_3 false RX_CC_NUM_SEQ 0 RX_CC_LEN_SEQ 1 RX_CC_PERIODICITY 5000 RX_CC_KEEP_IDLE DISABLE RX_CC_PRECEDENCE ENABLE RX_CC_REPEAT_WAIT 0 RX_CC_MASK 00000000 RX_CC_VAL', '00000000000000000000000000000000000000000000000000000000000000000000000000000000 RX_CC_K 00000000 RX_CC_DISP 00000000 RX_CC_MASK_0_0 false RX_CC_VAL_0_0 00000000 RX_CC_K_0_0 false RX_CC_DISP_0_0 false', 'RX_CC_MASK_0_1 false RX_CC_VAL_0_1 00000000 RX_CC_K_0_1 false RX_CC_DISP_0_1 false RX_CC_MASK_0_2 false RX_CC_VAL_0_2 00000000 RX_CC_K_0_2 false RX_CC_DISP_0_2 false RX_CC_MASK_0_3 false RX_CC_VAL_0_3', '00000000 RX_CC_K_0_3 false RX_CC_DISP_0_3 false RX_CC_MASK_1_0 false RX_CC_VAL_1_0 00000000 RX_CC_K_1_0 false RX_CC_DISP_1_0 false RX_CC_MASK_1_1 false RX_CC_VAL_1_1 00000000 RX_CC_K_1_1 false', 'RX_CC_DISP_1_1 false RX_CC_MASK_1_2 false RX_CC_VAL_1_2 00000000 RX_CC_K_1_2 false RX_CC_DISP_1_2 false RX_CC_MASK_1_3 false RX_CC_VAL_1_3 00000000 RX_CC_K_1_3 false RX_CC_DISP_1_3 false', 'PCIE_USERCLK2_FREQ 250 PCIE_USERCLK_FREQ 250 RX_JTOL_FC 6.1862627 RX_JTOL_LF_SLOPE -20 RX_BUFFER_BYPASS_MODE Fast_Sync RX_BUFFER_BYPASS_MODE_LANE MULTI RX_BUFFER_RESET_ON_CB_CHANGE ENABLE', 'RX_BUFFER_RESET_ON_COMMAALIGN DISABLE RX_BUFFER_RESET_ON_RATE_CHANGE ENABLE TX_BUFFER_RESET_ON_RATE_CHANGE ENABLE RESET_SEQUENCE_INTERVAL 0 RX_COMMA_PRESET NONE RX_COMMA_VALID_ONLY 0']} \
  CONFIG.IP_NO_OF_LANES 4 \
] [get_bd_cells bridge_refclkGTYP_REFCLK_X1Y2]
create_bd_cell -type ip -vlnv xilinx.com:ip:gt_quad_base:1.1 gt_quad_base_2
set_property -dict [list \
  CONFIG.APB3_CLK_FREQUENCY 124.998749 \
  CONFIG.BYPASS_DRC_58G false \
  CONFIG.CHANNEL_ORDERING {['/gt_quad_base_2/TX0_GT_IP_Interface versal_ibert_bridge_refclkGTYP_REFCLK_X1Y2_0./bridge_refclkGTYP_REFCLK_X1Y2/GT_TX0.0 /gt_quad_base_2/TX1_GT_IP_Interface', 'versal_ibert_bridge_refclkGTYP_REFCLK_X1Y2_0./bridge_refclkGTYP_REFCLK_X1Y2/GT_TX1.1 /gt_quad_base_2/TX2_GT_IP_Interface', 'versal_ibert_bridge_refclkGTYP_REFCLK_X1Y2_0./bridge_refclkGTYP_REFCLK_X1Y2/GT_TX2.2 /gt_quad_base_2/TX3_GT_IP_Interface', 'versal_ibert_bridge_refclkGTYP_REFCLK_X1Y2_0./bridge_refclkGTYP_REFCLK_X1Y2/GT_TX3.3 /gt_quad_base_2/RX0_GT_IP_Interface', 'versal_ibert_bridge_refclkGTYP_REFCLK_X1Y2_0./bridge_refclkGTYP_REFCLK_X1Y2/GT_RX0.0 /gt_quad_base_2/RX1_GT_IP_Interface', 'versal_ibert_bridge_refclkGTYP_REFCLK_X1Y2_0./bridge_refclkGTYP_REFCLK_X1Y2/GT_RX1.1 /gt_quad_base_2/RX2_GT_IP_Interface', 'versal_ibert_bridge_refclkGTYP_REFCLK_X1Y2_0./bridge_refclkGTYP_REFCLK_X1Y2/GT_RX2.2 /gt_quad_base_2/RX3_GT_IP_Interface', 'versal_ibert_bridge_refclkGTYP_REFCLK_X1Y2_0./bridge_refclkGTYP_REFCLK_X1Y2/GT_RX3.3']} \
  CONFIG.GT_TYPE GTYP \
  CONFIG.PORTS_INFO_DICT {LANE_SEL_DICT {PROT0 {RX0 RX1 RX2 RX3 TX0 TX1 TX2 TX3}} GT_TYPE GTYP REG_CONF_INTF APB3_INTF BOARD_PARAMETER { }} \
  CONFIG.PROT0_ENABLE true \
  CONFIG.PROT0_GT_DIRECTION DUPLEX \
  CONFIG.PROT0_LR0_SETTINGS {['GT_DIRECTION DUPLEX TX_PAM_SEL NRZ TX_HD_EN 0 TX_GRAY_BYP true TX_GRAY_LITTLEENDIAN true TX_PRECODE_BYP true TX_PRECODE_LITTLEENDIAN false TX_LINE_RATE 10.3125 TX_PLL_TYPE LCPLL TX_REFCLK_FREQUENCY', '156.25 TX_ACTUAL_REFCLK_FREQUENCY 156.250000000000 TX_FRACN_ENABLED false TX_FRACN_OVRD false TX_FRACN_NUMERATOR 0 TX_REFCLK_SOURCE R0 TX_DATA_ENCODING RAW TX_USER_DATA_WIDTH 32 TX_INT_DATA_WIDTH 32', 'TX_BUFFER_MODE 1 TX_BUFFER_BYPASS_MODE Fast_Sync TX_PIPM_ENABLE false TX_OUTCLK_SOURCE TXOUTCLKPMA TXPROGDIV_FREQ_ENABLE false TXPROGDIV_FREQ_SOURCE LCPLL TXPROGDIV_FREQ_VAL 322.265625', 'TX_DIFF_SWING_EMPH_MODE CUSTOM TX_64B66B_SCRAMBLER false TX_64B66B_ENCODER false TX_64B66B_CRC false TX_RATE_GROUP A TX_LANE_DESKEW_HDMI_ENABLE false TX_BUFFER_RESET_ON_RATE_CHANGE ENABLE PRESET None', 'RX_PAM_SEL NRZ RX_HD_EN 0 RX_GRAY_BYP true RX_GRAY_LITTLEENDIAN true RX_PRECODE_BYP true RX_PRECODE_LITTLEENDIAN false INTERNAL_PRESET None RX_LINE_RATE 10.3125 RX_PLL_TYPE LCPLL RX_REFCLK_FREQUENCY', '156.25 RX_ACTUAL_REFCLK_FREQUENCY 156.250000000000 RX_FRACN_ENABLED false RX_FRACN_OVRD false RX_FRACN_NUMERATOR 0 RX_REFCLK_SOURCE R0 RX_DATA_DECODING RAW RX_USER_DATA_WIDTH 32 RX_INT_DATA_WIDTH 32', 'RX_BUFFER_MODE 1 RX_OUTCLK_SOURCE RXOUTCLKPMA RXPROGDIV_FREQ_ENABLE false RXPROGDIV_FREQ_SOURCE LCPLL RXPROGDIV_FREQ_VAL 322.265625 RXRECCLK_FREQ_ENABLE false RXRECCLK_FREQ_VAL 0 INS_LOSS_NYQ 20', 'RX_EQ_MODE AUTO RX_COUPLING AC RX_TERMINATION PROGRAMMABLE RX_RATE_GROUP A RX_TERMINATION_PROG_VALUE 800 RX_PPM_OFFSET 0 RX_64B66B_DESCRAMBLER false RX_64B66B_DECODER false RX_64B66B_CRC false', 'OOB_ENABLE false RX_COMMA_ALIGN_WORD 1 RX_COMMA_SHOW_REALIGN_ENABLE true PCIE_ENABLE false RX_COMMA_P_ENABLE false RX_COMMA_M_ENABLE false RX_COMMA_DOUBLE_ENABLE false RX_COMMA_P_VAL 0101111100', 'RX_COMMA_M_VAL 1010000011 RX_COMMA_MASK 0000000000 RX_SLIDE_MODE OFF RX_SSC_PPM 0 RX_CB_NUM_SEQ 0 RX_CB_LEN_SEQ 1 RX_CB_MAX_SKEW 1 RX_CB_MAX_LEVEL 1 RX_CB_MASK 00000000 RX_CB_VAL', '00000000000000000000000000000000000000000000000000000000000000000000000000000000 RX_CB_K 00000000 RX_CB_DISP 00000000 RX_CB_MASK_0_0 false RX_CB_VAL_0_0 00000000 RX_CB_K_0_0 false RX_CB_DISP_0_0 false', 'RX_CB_MASK_0_1 false RX_CB_VAL_0_1 00000000 RX_CB_K_0_1 false RX_CB_DISP_0_1 false RX_CB_MASK_0_2 false RX_CB_VAL_0_2 00000000 RX_CB_K_0_2 false RX_CB_DISP_0_2 false RX_CB_MASK_0_3 false RX_CB_VAL_0_3', '00000000 RX_CB_K_0_3 false RX_CB_DISP_0_3 false RX_CB_MASK_1_0 false RX_CB_VAL_1_0 00000000 RX_CB_K_1_0 false RX_CB_DISP_1_0 false RX_CB_MASK_1_1 false RX_CB_VAL_1_1 00000000 RX_CB_K_1_1 false', 'RX_CB_DISP_1_1 false RX_CB_MASK_1_2 false RX_CB_VAL_1_2 00000000 RX_CB_K_1_2 false RX_CB_DISP_1_2 false RX_CB_MASK_1_3 false RX_CB_VAL_1_3 00000000 RX_CB_K_1_3 false RX_CB_DISP_1_3 false RX_CC_NUM_SEQ', '0 RX_CC_LEN_SEQ 1 RX_CC_PERIODICITY 5000 RX_CC_KEEP_IDLE DISABLE RX_CC_PRECEDENCE ENABLE RX_CC_REPEAT_WAIT 0 RX_CC_MASK 00000000 RX_CC_VAL', '00000000000000000000000000000000000000000000000000000000000000000000000000000000 RX_CC_K 00000000 RX_CC_DISP 00000000 RX_CC_MASK_0_0 false RX_CC_VAL_0_0 00000000 RX_CC_K_0_0 false RX_CC_DISP_0_0 false', 'RX_CC_MASK_0_1 false RX_CC_VAL_0_1 00000000 RX_CC_K_0_1 false RX_CC_DISP_0_1 false RX_CC_MASK_0_2 false RX_CC_VAL_0_2 00000000 RX_CC_K_0_2 false RX_CC_DISP_0_2 false RX_CC_MASK_0_3 false RX_CC_VAL_0_3', '00000000 RX_CC_K_0_3 false RX_CC_DISP_0_3 false RX_CC_MASK_1_0 false RX_CC_VAL_1_0 00000000 RX_CC_K_1_0 false RX_CC_DISP_1_0 false RX_CC_MASK_1_1 false RX_CC_VAL_1_1 00000000 RX_CC_K_1_1 false', 'RX_CC_DISP_1_1 false RX_CC_MASK_1_2 false RX_CC_VAL_1_2 00000000 RX_CC_K_1_2 false RX_CC_DISP_1_2 false RX_CC_MASK_1_3 false RX_CC_VAL_1_3 00000000 RX_CC_K_1_3 false RX_CC_DISP_1_3 false', 'PCIE_USERCLK2_FREQ 250 PCIE_USERCLK_FREQ 250 RX_JTOL_FC 6.1862627 RX_JTOL_LF_SLOPE -20 RX_BUFFER_BYPASS_MODE Fast_Sync RX_BUFFER_BYPASS_MODE_LANE MULTI RX_BUFFER_RESET_ON_CB_CHANGE ENABLE', 'RX_BUFFER_RESET_ON_COMMAALIGN DISABLE RX_BUFFER_RESET_ON_RATE_CHANGE ENABLE RESET_SEQUENCE_INTERVAL 0 RX_COMMA_PRESET NONE RX_COMMA_VALID_ONLY 0 GT_TYPE GTYP']} \
  CONFIG.PROT0_LR10_SETTINGS {NA NA} \
  CONFIG.PROT0_LR11_SETTINGS {NA NA} \
  CONFIG.PROT0_LR12_SETTINGS {NA NA} \
  CONFIG.PROT0_LR13_SETTINGS {NA NA} \
  CONFIG.PROT0_LR14_SETTINGS {NA NA} \
  CONFIG.PROT0_LR15_SETTINGS {NA NA} \
  CONFIG.PROT0_LR1_SETTINGS {NA NA} \
  CONFIG.PROT0_LR2_SETTINGS {NA NA} \
  CONFIG.PROT0_LR3_SETTINGS {NA NA} \
  CONFIG.PROT0_LR4_SETTINGS {NA NA} \
  CONFIG.PROT0_LR5_SETTINGS {NA NA} \
  CONFIG.PROT0_LR6_SETTINGS {NA NA} \
  CONFIG.PROT0_LR7_SETTINGS {NA NA} \
  CONFIG.PROT0_LR8_SETTINGS {NA NA} \
  CONFIG.PROT0_LR9_SETTINGS {NA NA} \
  CONFIG.PROT0_NO_OF_LANES 4 \
  CONFIG.PROT0_RX_MASTERCLK_SRC RX0 \
  CONFIG.PROT0_TX_MASTERCLK_SRC TX0 \
  CONFIG.QUAD_USAGE {['TX_QUAD_CH {', 'TXQuad_0_/gt_quad_base_2 {/gt_quad_base_2', 'versal_ibert_bridge_refclkGTYP_REFCLK_X1Y2_0.IP_CH0,versal_ibert_bridge_refclkGTYP_REFCLK_X1Y2_0.IP_CH1,versal_ibert_bridge_refclkGTYP_REFCLK_X1Y2_0.IP_CH2,versal_ibert_bridge_refclkGTYP_REFCLK_X1Y2_0.IP_CH3', 'MSTRCLK 1,0,0,0 IS_CURRENT_QUAD 1}', '}', 'RX_QUAD_CH {', 'RXQuad_0_/gt_quad_base_2 {/gt_quad_base_2', 'versal_ibert_bridge_refclkGTYP_REFCLK_X1Y2_0.IP_CH0,versal_ibert_bridge_refclkGTYP_REFCLK_X1Y2_0.IP_CH1,versal_ibert_bridge_refclkGTYP_REFCLK_X1Y2_0.IP_CH2,versal_ibert_bridge_refclkGTYP_REFCLK_X1Y2_0.IP_CH3', 'MSTRCLK 1,0,0,0 IS_CURRENT_QUAD 1}', '}']} \
  CONFIG.REFCLK_LIST {{/bridge_refclkGTYP_REFCLK_X1Y2_diff_gt_ref_clock_clk_p[0]}} \
  CONFIG.REFCLK_STRING {HSCLK0_LCPLLGTREFCLK0 refclk_PROT0_R0_156.25_MHz_unique1 HSCLK1_LCPLLGTREFCLK0 refclk_PROT0_R0_156.25_MHz_unique1} \
  CONFIG.REG_CONF_INTF APB3_INTF \
  CONFIG.RX0_LANE_SEL PROT0 \
  CONFIG.RX1_LANE_SEL PROT0 \
  CONFIG.RX2_LANE_SEL PROT0 \
  CONFIG.RX3_LANE_SEL PROT0 \
  CONFIG.TX0_LANE_SEL PROT0 \
  CONFIG.TX1_LANE_SEL PROT0 \
  CONFIG.TX2_LANE_SEL PROT0 \
  CONFIG.TX3_LANE_SEL PROT0 \
] [get_bd_cells gt_quad_base_2]
create_bd_cell -type ip -vlnv xilinx.com:ip:bufg_gt:1.0 bufg_gt_4
create_bd_cell -type ip -vlnv xilinx.com:ip:bufg_gt:1.0 bufg_gt_5
create_bd_cell -type ip -vlnv xilinx.com:ip:util_reduced_logic:2.0 urlp_2
set_property -dict {CONFIG.C_SIZE 1} [get_bd_cells urlp_2]
create_bd_cell -type ip -vlnv xilinx.com:ip:xlconcat:2.1 xlcp_2
set_property -dict {CONFIG.NUM_PORTS 1} [get_bd_cells xlcp_2]
create_bd_cell -type ip -vlnv xilinx.com:ip:util_ds_buf:2.2 util_ds_buf_2
set_property -dict {CONFIG.C_BUF_TYPE IBUFDSGTE} [get_bd_cells util_ds_buf_2]
create_bd_cell -type ip -vlnv xilinx.com:ip:gt_bridge_ip:1.1 bridge_refclkGTM_REFCLK_X0Y0
set_property -dict [list \
  CONFIG.GT_TYPE GTM \
  CONFIG.IP_LR0_SETTINGS {['PRESET None RX_PAM_SEL PAM4 TX_PAM_SEL PAM4 TX_HD_EN 0 RX_HD_EN 0 RX_GRAY_BYP true TX_GRAY_BYP true RX_GRAY_LITTLEENDIAN true TX_GRAY_LITTLEENDIAN true RX_PRECODE_BYP true TX_PRECODE_BYP true', 'RX_PRECODE_LITTLEENDIAN false TX_PRECODE_LITTLEENDIAN false INTERNAL_PRESET None GT_TYPE GTM GT_DIRECTION DUPLEX TX_LINE_RATE 53.125 TX_PLL_TYPE LCPLL TX_REFCLK_FREQUENCY 156.25', 'TX_ACTUAL_REFCLK_FREQUENCY 156.250000000000 TX_FRACN_ENABLED false TX_FRACN_OVRD false TX_FRACN_NUMERATOR 0 TX_REFCLK_SOURCE R0 TX_DATA_ENCODING RAW TX_USER_DATA_WIDTH 160 TX_INT_DATA_WIDTH 128', 'TX_BUFFER_MODE 1 TX_BUFFER_BYPASS_MODE Fast_Sync TX_PIPM_ENABLE false TX_OUTCLK_SOURCE TXPROGDIVCLK TXPROGDIV_FREQ_ENABLE true TXPROGDIV_FREQ_SOURCE LCPLL TXPROGDIV_FREQ_VAL 332.031', 'TX_DIFF_SWING_EMPH_MODE CUSTOM TX_64B66B_SCRAMBLER false TX_64B66B_ENCODER false TX_64B66B_CRC false TX_RATE_GROUP A RX_LINE_RATE 53.125 RX_PLL_TYPE LCPLL RX_REFCLK_FREQUENCY 156.25', 'RX_ACTUAL_REFCLK_FREQUENCY 156.250000000000 RX_FRACN_ENABLED false RX_FRACN_OVRD false RX_FRACN_NUMERATOR 0 RX_REFCLK_SOURCE R0 RX_DATA_DECODING RAW RX_USER_DATA_WIDTH 160 RX_INT_DATA_WIDTH 128', 'RX_BUFFER_MODE 1 RX_OUTCLK_SOURCE RXPROGDIVCLK RXPROGDIV_FREQ_ENABLE true RXPROGDIV_FREQ_SOURCE LCPLL RXPROGDIV_FREQ_VAL 332.031 RXRECCLK_FREQ_ENABLE false RXRECCLK_FREQ_VAL 0 INS_LOSS_NYQ 20', 'RX_EQ_MODE AUTO RX_COUPLING AC RX_TERMINATION VCOM_VREF RX_RATE_GROUP A RX_TERMINATION_PROG_VALUE 800 RX_PPM_OFFSET 0 RX_64B66B_DESCRAMBLER false RX_64B66B_DECODER false RX_64B66B_CRC false OOB_ENABLE', 'false RX_COMMA_ALIGN_WORD 1 RX_COMMA_SHOW_REALIGN_ENABLE true PCIE_ENABLE false TX_LANE_DESKEW_HDMI_ENABLE false RX_COMMA_P_ENABLE false RX_COMMA_M_ENABLE false RX_COMMA_DOUBLE_ENABLE false', 'RX_COMMA_P_VAL 0101111100 RX_COMMA_M_VAL 1010000011 RX_COMMA_MASK 0000000000 RX_SLIDE_MODE OFF RX_SSC_PPM 0 RX_CB_NUM_SEQ 0 RX_CB_LEN_SEQ 1 RX_CB_MAX_SKEW 1 RX_CB_MAX_LEVEL 1 RX_CB_MASK 00000000', 'RX_CB_VAL 00000000000000000000000000000000000000000000000000000000000000000000000000000000 RX_CB_K 00000000 RX_CB_DISP 00000000 RX_CB_MASK_0_0 false RX_CB_VAL_0_0 0000000000 RX_CB_K_0_0 false', 'RX_CB_DISP_0_0 false RX_CB_MASK_0_1 false RX_CB_VAL_0_1 0000000000 RX_CB_K_0_1 false RX_CB_DISP_0_1 false RX_CB_MASK_0_2 false RX_CB_VAL_0_2 0000000000 RX_CB_K_0_2 false RX_CB_DISP_0_2 false', 'RX_CB_MASK_0_3 false RX_CB_VAL_0_3 0000000000 RX_CB_K_0_3 false RX_CB_DISP_0_3 false RX_CB_MASK_1_0 false RX_CB_VAL_1_0 0000000000 RX_CB_K_1_0 false RX_CB_DISP_1_0 false RX_CB_MASK_1_1 false', 'RX_CB_VAL_1_1 0000000000 RX_CB_K_1_1 false RX_CB_DISP_1_1 false RX_CB_MASK_1_2 false RX_CB_VAL_1_2 0000000000 RX_CB_K_1_2 false RX_CB_DISP_1_2 false RX_CB_MASK_1_3 false RX_CB_VAL_1_3 0000000000', 'RX_CB_K_1_3 false RX_CB_DISP_1_3 false RX_CC_NUM_SEQ 0 RX_CC_LEN_SEQ 1 RX_CC_PERIODICITY 5000 RX_CC_KEEP_IDLE DISABLE RX_CC_PRECEDENCE ENABLE RX_CC_REPEAT_WAIT 0 RX_CC_MASK 00000000 RX_CC_VAL', '00000000000000000000000000000000000000000000000000000000000000000000000000000000 RX_CC_K 00000000 RX_CC_DISP 00000000 RX_CC_MASK_0_0 false RX_CC_VAL_0_0 0000000000 RX_CC_K_0_0 false RX_CC_DISP_0_0', 'false RX_CC_MASK_0_1 false RX_CC_VAL_0_1 0000000000 RX_CC_K_0_1 false RX_CC_DISP_0_1 false RX_CC_MASK_0_2 false RX_CC_VAL_0_2 0000000000 RX_CC_K_0_2 false RX_CC_DISP_0_2 false RX_CC_MASK_0_3 false', 'RX_CC_VAL_0_3 0000000000 RX_CC_K_0_3 false RX_CC_DISP_0_3 false RX_CC_MASK_1_0 false RX_CC_VAL_1_0 0000000000 RX_CC_K_1_0 false RX_CC_DISP_1_0 false RX_CC_MASK_1_1 false RX_CC_VAL_1_1 0000000000', 'RX_CC_K_1_1 false RX_CC_DISP_1_1 false RX_CC_MASK_1_2 false RX_CC_VAL_1_2 0000000000 RX_CC_K_1_2 false RX_CC_DISP_1_2 false RX_CC_MASK_1_3 false RX_CC_VAL_1_3 0000000000 RX_CC_K_1_3 false', 'RX_CC_DISP_1_3 false PCIE_USERCLK2_FREQ 250 PCIE_USERCLK_FREQ 250 RX_JTOL_FC 10 RX_JTOL_LF_SLOPE -20 RX_BUFFER_BYPASS_MODE Fast_Sync RX_BUFFER_BYPASS_MODE_LANE MULTI RX_BUFFER_RESET_ON_CB_CHANGE', 'ENABLE RX_BUFFER_RESET_ON_COMMAALIGN DISABLE RX_BUFFER_RESET_ON_RATE_CHANGE ENABLE TX_BUFFER_RESET_ON_RATE_CHANGE ENABLE RESET_SEQUENCE_INTERVAL 0 RX_COMMA_PRESET NONE RX_COMMA_VALID_ONLY 0']} \
  CONFIG.IP_NO_OF_LANES 4 \
] [get_bd_cells bridge_refclkGTM_REFCLK_X0Y0]
create_bd_cell -type ip -vlnv xilinx.com:ip:gt_quad_base:1.1 gt_quad_base_3
